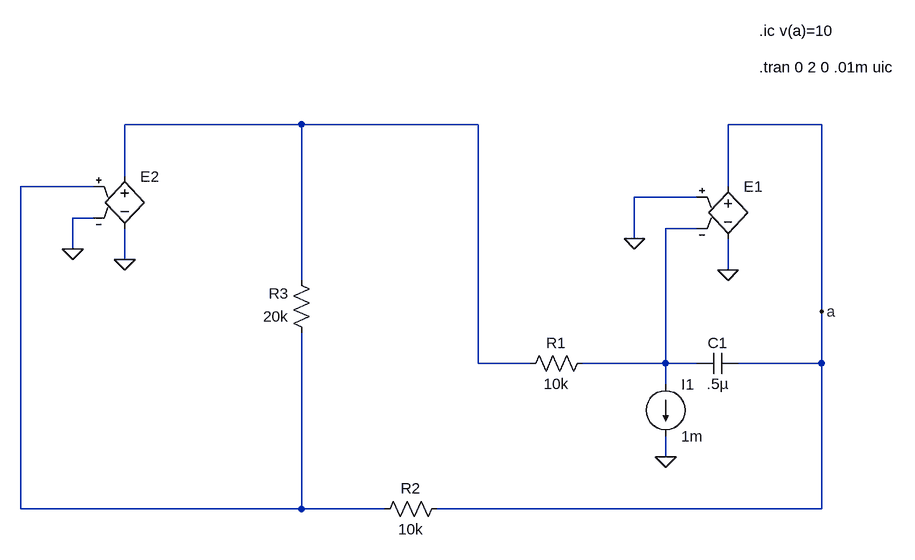
[diagram p0: schematic triang1.asc]
triang1.asc, the LTspice schematic file:
Version 4
SHEET 1 1748 680
WIRE 32 -144 -240 -144
WIRE 304 -144 32 -144
WIRE 832 -144 688 -144
WIRE -240 -64 -240 -144
WIRE -288 -48 -400 -48
WIRE 688 -48 688 -144
WIRE 640 -32 544 -32
WIRE -288 0 -320 0
WIRE 640 16 592 16
WIRE 544 32 544 -32
WIRE -320 48 -320 0
WIRE -240 64 -240 16
WIRE 688 80 688 32
WIRE 32 96 32 -144
WIRE 832 144 832 -144
WIRE 304 224 304 -144
WIRE 384 224 304 224
WIRE 592 224 592 16
WIRE 592 224 464 224
WIRE 640 224 592 224
WIRE 832 224 832 144
WIRE 832 224 704 224
WIRE 592 256 592 224
WIRE 592 368 592 336
WIRE -400 448 -400 -48
WIRE 32 448 32 176
WIRE 32 448 -400 448
WIRE 160 448 32 448
WIRE 832 448 832 224
WIRE 832 448 240 448
FLAG 688 80 0
FLAG -240 64 0
FLAG 544 32 0
FLAG -320 48 0
FLAG 832 144 a
FLAG 592 368 0
SYMBOL e 688 -64 R0
WINDOW 3 24 96 Invisible 2
SYMATTR Value table=(-100,-12)(-60u,-12)(60u,12)(100,12)
SYMATTR InstName E1
SYMBOL e -240 -80 R0
WINDOW 3 24 96 Invisible 2
SYMATTR Value table=(-100,-12)(-60u,-12)(60u,12)(100,12)
SYMATTR InstName E2
SYMBOL cap 704 208 R90
WINDOW 0 0 32 VBottom 2
WINDOW 3 32 32 VTop 2
SYMATTR InstName C1
SYMATTR Value .5µ
SYMBOL res 480 208 R90
WINDOW 0 0 56 VBottom 2
WINDOW 3 32 56 VTop 2
SYMATTR InstName R1
SYMATTR Value 10k
SYMBOL res 256 432 R90
WINDOW 0 0 56 VBottom 2
WINDOW 3 32 56 VTop 2
SYMATTR InstName R2
SYMATTR Value 10k
SYMBOL res 48 192 R180
WINDOW 0 36 76 Left 2
WINDOW 3 36 40 Left 2
SYMATTR InstName R3
SYMATTR Value 20k
SYMBOL current 592 256 R0
WINDOW 123 0 0 Left 2
WINDOW 39 0 0 Left 2
SYMATTR InstName I1
SYMATTR Value 1m
TEXT 736 -288 Left 2 !.ic v(a)=10
TEXT 736 -232 Left 2 !.tran 0 2 0 .01m uic

The netlist it stands for:
* triang1.asc
E1 a 0 0 N003 table=(-100,-12)(-60u,-12)(60u,12)(100,12)
E2 N001 0 N002 0 table=(-100,-12)(-60u,-12)(60u,12)(100,12)
C1 a N003 .5µ
R1 N003 N001 10k
R2 a N002 10k
R3 N002 N001 20k
I1 N003 0 1m
.ic v(a)=10
.tran 0 2 0 .01m uic
.backanno
.end